# Altium schematic sheet FPGA.SchDoc
size A3
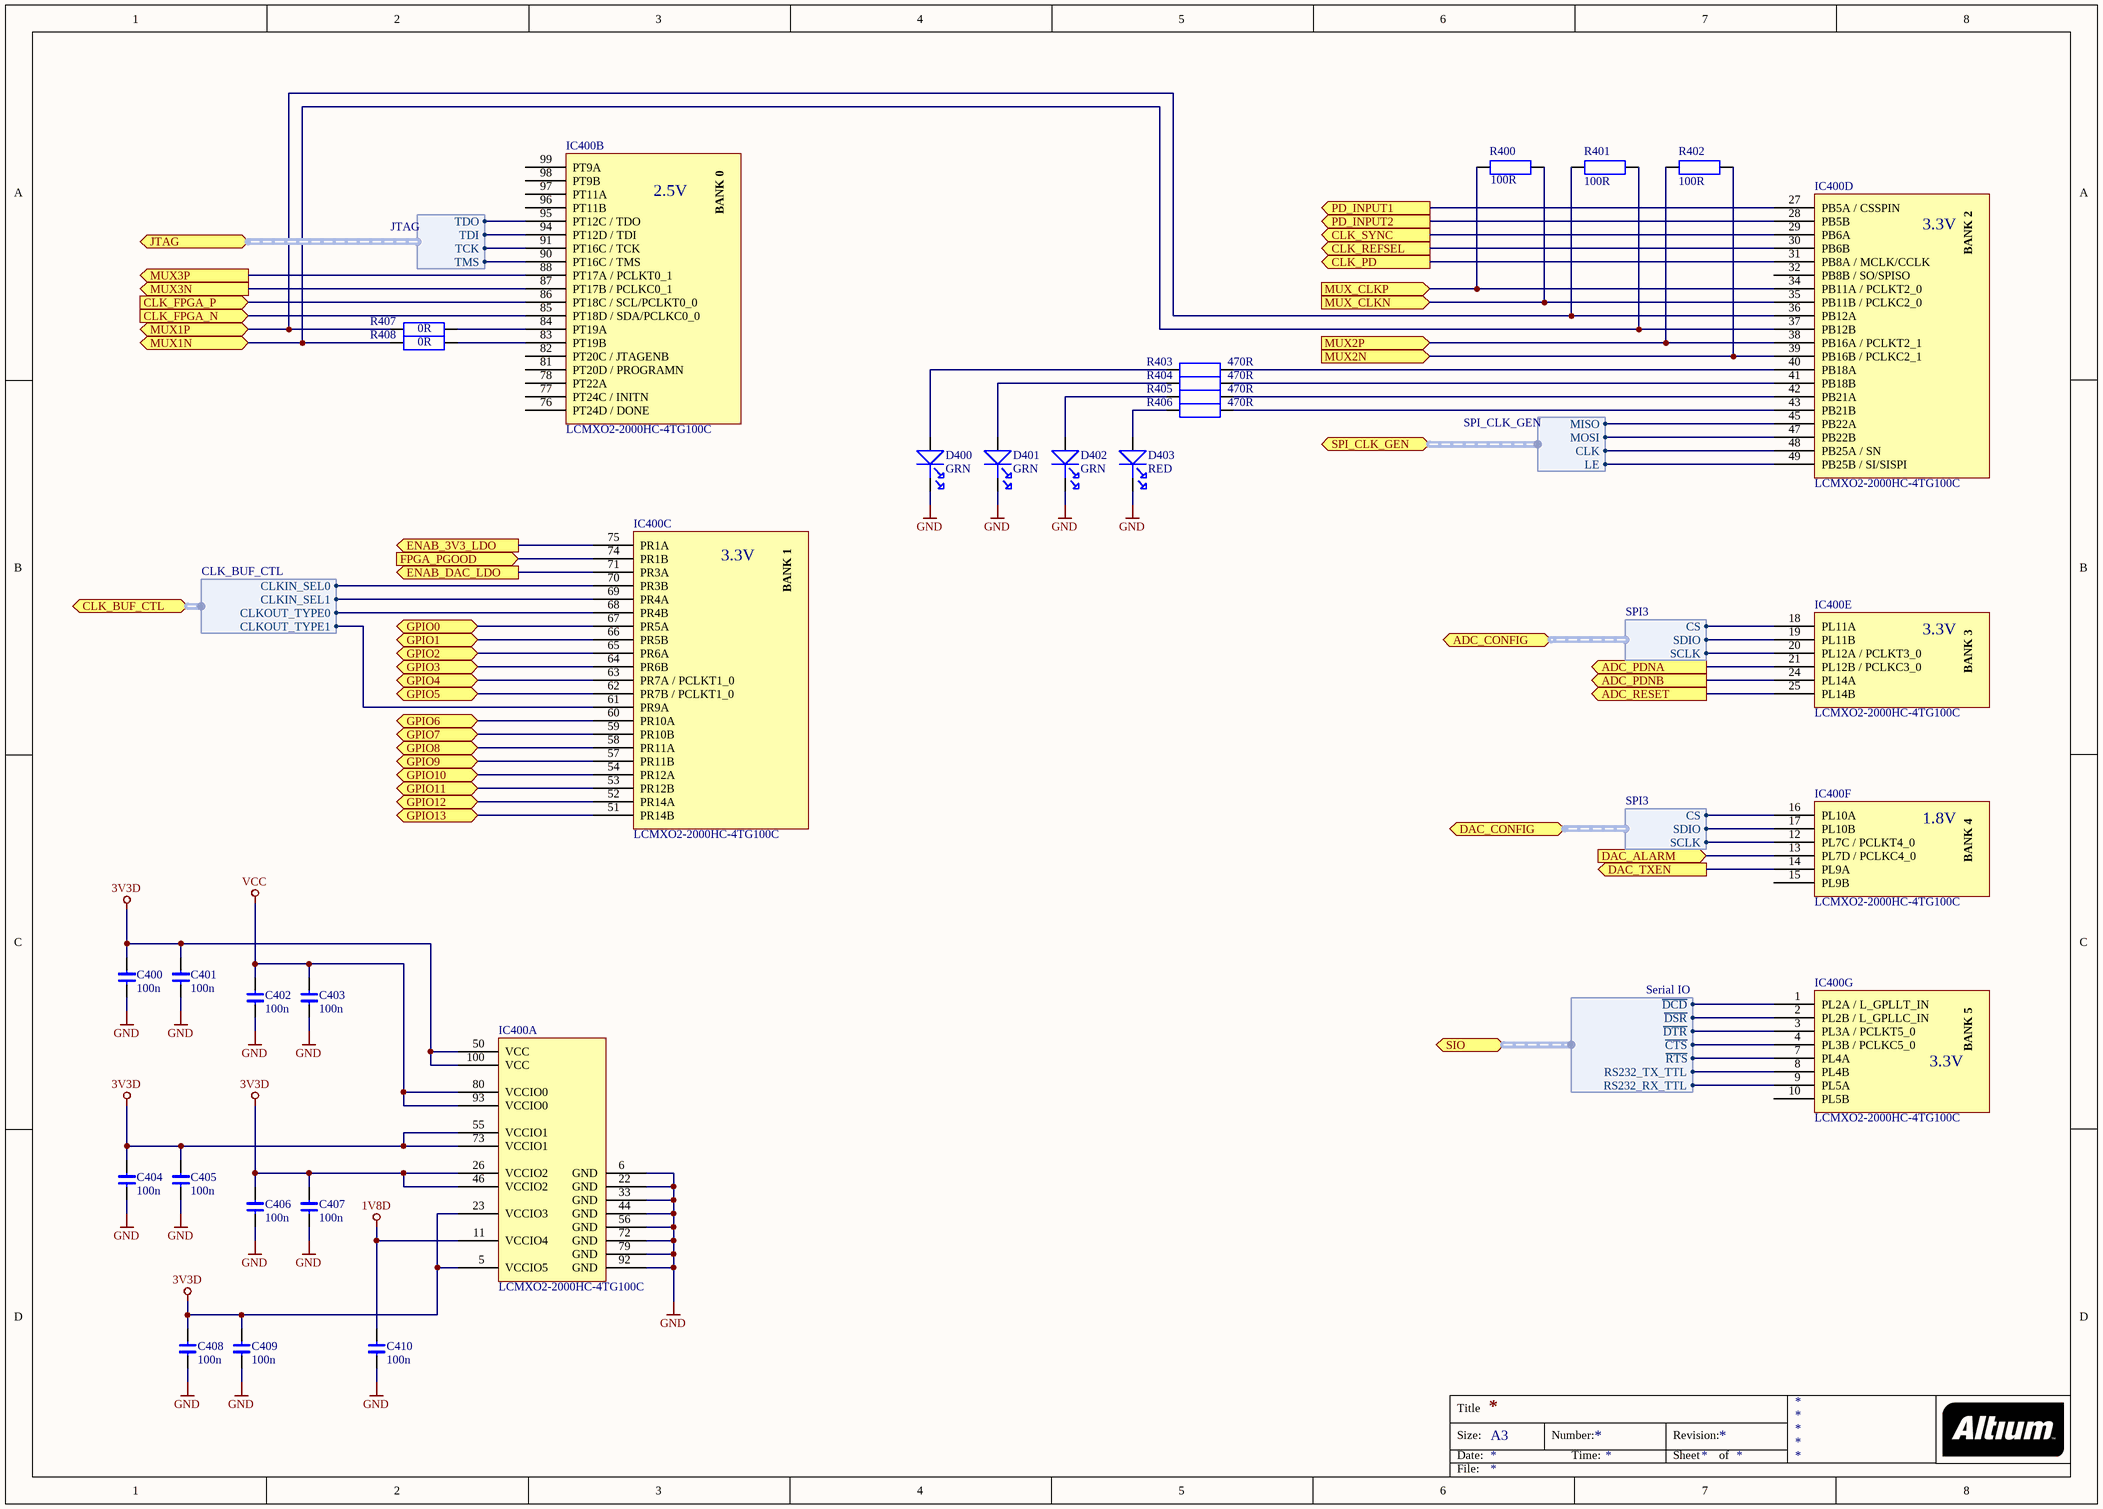
[diagram p0: FPGA.SchDoc]

## Parts
C400  100n  [0603 SMALL OUTLINE]
C401  100n  [0603 SMALL OUTLINE]
C402  100n  [0603 SMALL OUTLINE]
C403  100n  [0603 SMALL OUTLINE]
C404  100n  [0603 SMALL OUTLINE]
C405  100n  [0603 SMALL OUTLINE]
C406  100n  [0603 SMALL OUTLINE]
C407  100n  [0603 SMALL OUTLINE]
C408  100n  [0603 SMALL OUTLINE]
C409  100n  [0603 SMALL OUTLINE]
C410  100n  [0603 SMALL OUTLINE]
D400  GRN  [LED SMD 0603]
D401  GRN  [LED SMD 0603]
D402  GRN  [LED SMD 0603]
D403  RED  [LED SMD 0603]
IC400  LCMXO2-2000HC-4TG100C  [TQFP100]  (parts A,B,C,D,E,F,G of 7)
R400  100R  [0402]
R401  100R  [0402]
R402  100R  [0402]
R403  470R  [0603 SMALL OUTLINE]
R404  470R  [0603 SMALL OUTLINE]
R405  470R  [0603 SMALL OUTLINE]
R406  470R  [0603 SMALL OUTLINE]
R407  0R  [0402]
R408  0R  [0402]

## Ports
ADC_CONFIG (harness SPI3), ADC_PDNA (out), ADC_PDNB (out), ADC_RESET (out), CLK_BUF_CTL (harness CLK_BUF_CTL), CLK_FPGA_N (in), CLK_FPGA_P (in), CLK_PD (out), CLK_REFSEL (out), CLK_SYNC (out), DAC_ALARM (in), DAC_CONFIG (harness SPI3), DAC_TXEN (out), ENAB_3V3_LDO (out), ENAB_DAC_LDO (out), FPGA_PGOOD (in), GPIO0, GPIO1, GPIO2, GPIO3, GPIO4, GPIO5, GPIO6, GPIO7, GPIO8, GPIO9, GPIO10, GPIO11, GPIO12, GPIO13, JTAG (harness JTAG), MUX1N, MUX1P, MUX2N (in), MUX2P (in), MUX3N (out), MUX3P (out), MUX_CLKN (in), MUX_CLKP (in), PD_INPUT1 (out), PD_INPUT2 (out), SIO (harness Serial IO), SPI_CLK_GEN (harness SPI_CLK_GEN)

## Harnesses
JTAG: TCK, TDI, TDO, TMS
Serial IO: RS232_RX_TTL, RS232_TX_TTL, ~{RTS}, ~{CTS}, ~{DTR}, ~{DSR}, ~{DCD}
SPI3: SDIO, SCLK, CS
SPI_CLK_GEN: MISO, MOSI, CLK, LE
CLK_BUF_CTL: CLKIN_SEL0, CLKIN_SEL1, CLKOUT_TYPE0, CLKOUT_TYPE1

## Nets
1V8D: C410.1 IC400.11(VCCIO4)
3V3D: C400.1 C401.1 C404.1 C405.1 C406.1 C407.1 C408.1 C409.1 IC400.5(VCCIO5) IC400.23(VCCIO3) IC400.26(VCCIO2) IC400.46(VCCIO2) IC400.50(VCC) IC400.55(VCCIO1) IC400.73(VCCIO1) IC400.100(VCC)
GND: C400.2 C401.2 C402.2 C403.2 C404.2 C405.2 C406.2 C407.2 C408.2 C409.2 C410.2 D400.K D401.K D402.K D403.K IC400.6(GND) IC400.22(GND) IC400.33(GND) IC400.44(GND) IC400.56(GND) IC400.72(GND) IC400.79(GND) IC400.92(GND)
VCC: C402.1 C403.1 IC400.80(VCCIO0) IC400.93(VCCIO0)
ADC_PDNA: IC400.21(PL12B_/_PCLKC3_0) ; port ADC_PDNA
ADC_PDNB: IC400.24(PL14A) ; port ADC_PDNB
ADC_RESET: IC400.25(PL14B) ; port ADC_RESET
CLK_FPGA_N: IC400.85(PT18D_/_SDA/PCLKC0_0) ; port CLK_FPGA_N
CLK_FPGA_P: IC400.86(PT18C_/_SCL/PCLKT0_0) ; port CLK_FPGA_P
CLK_PD: IC400.31(PB8A_/_MCLK/CCLK) ; port CLK_PD
CLK_REFSEL: IC400.30(PB6B) ; port CLK_REFSEL
CLK_SYNC: IC400.29(PB6A) ; port CLK_SYNC
DAC_ALARM: IC400.13(PL7D_/_PCLKC4_0) ; port DAC_ALARM
DAC_TXEN: IC400.14(PL9A) ; port DAC_TXEN
ENAB_3V3_LDO: IC400.75(PR1A) ; port ENAB_3V3_LDO
ENAB_DAC_LDO: IC400.71(PR3A) ; port ENAB_DAC_LDO
FPGA_PGOOD: IC400.74(PR1B) ; port FPGA_PGOOD
GPIO0: IC400.67(PR5A) ; port GPIO0
GPIO1: IC400.66(PR5B) ; port GPIO1
GPIO2: IC400.65(PR6A) ; port GPIO2
GPIO3: IC400.64(PR6B) ; port GPIO3
GPIO4: IC400.63(PR7A_/_PCLKT1_0) ; port GPIO4
GPIO5: IC400.62(PR7B_/_PCLKT1_0) ; port GPIO5
GPIO6: IC400.60(PR10A) ; port GPIO6
GPIO7: IC400.59(PR10B) ; port GPIO7
GPIO8: IC400.58(PR11A) ; port GPIO8
GPIO9: IC400.57(PR11B) ; port GPIO9
GPIO10: IC400.54(PR12A) ; port GPIO10
GPIO11: IC400.53(PR12B) ; port GPIO11
GPIO12: IC400.52(PR14A) ; port GPIO12
GPIO13: IC400.51(PR14B) ; port GPIO13
MUX1N: IC400.37(PB12B) R401.1 R408.2 ; port MUX1N
MUX1P: IC400.36(PB12A) R401.2 R407.2 ; port MUX1P
MUX2N: IC400.39(PB16B_/_PCLKC2_1) R402.1 ; port MUX2N
MUX2P: IC400.38(PB16A_/_PCLKT2_1) R402.2 ; port MUX2P
MUX3N: IC400.87(PT17B_/_PCLKC0_1) ; port MUX3N
MUX3P: IC400.88(PT17A_/_PCLKT0_1) ; port MUX3P
MUX_CLKN: IC400.35(PB11B_/_PCLKC2_0) R400.1 ; port MUX_CLKN
MUX_CLKP: IC400.34(PB11A_/_PCLKT2_0) R400.2 ; port MUX_CLKP
PD_INPUT1: IC400.27(PB5A_/_CSSPIN) ; port PD_INPUT1
PD_INPUT2: IC400.28(PB5B) ; port PD_INPUT2
NetD400_A: D400.A R403.2
NetD401_A: D401.A R404.2
NetD402_A: D402.A R405.2
NetD403_A: D403.A R406.2
NetIC400_1: IC400.1(PL2A_/_L_GPLLT_IN) ; port SIO.~{DCD}
NetIC400_2: IC400.2(PL2B_/_L_GPLLC_IN) ; port SIO.~{DSR}
NetIC400_3: IC400.3(PL3A_/_PCLKT5_0) ; port SIO.~{DTR}
NetIC400_4: IC400.4(PL3B_/_PCLKC5_0) ; port SIO.~{CTS}
NetIC400_7: IC400.7(PL4A) ; port SIO.~{RTS}
NetIC400_8: IC400.8(PL4B) ; port SIO.RS232_TX_TTL
NetIC400_9: IC400.9(PL5A) ; port SIO.RS232_RX_TTL
NetIC400_12: IC400.12(PL7C_/_PCLKT4_0) ; port DAC_CONFIG.SCLK
NetIC400_16: IC400.16(PL10A) ; port DAC_CONFIG.CS
NetIC400_17: IC400.17(PL10B) ; port DAC_CONFIG.SDIO
NetIC400_18: IC400.18(PL11A) ; port ADC_CONFIG.CS
NetIC400_19: IC400.19(PL11B) ; port ADC_CONFIG.SDIO
NetIC400_20: IC400.20(PL12A_/_PCLKT3_0) ; port ADC_CONFIG.SCLK
NetIC400_40: IC400.40(PB18A) R403.1
NetIC400_41: IC400.41(PB18B) R404.1
NetIC400_42: IC400.42(PB21A) R405.1
NetIC400_43: IC400.43(PB21B) R406.1
NetIC400_45: IC400.45(PB22A) ; port SPI_CLK_GEN.MISO
NetIC400_47: IC400.47(PB22B) ; port SPI_CLK_GEN.MOSI
NetIC400_48: IC400.48(PB25A_/_SN) ; port SPI_CLK_GEN.CLK
NetIC400_49: IC400.49(PB25B_/_SI/SISPI) ; port SPI_CLK_GEN.LE
NetIC400_61: IC400.61(PR9A) ; port CLK_BUF_CTL.CLKOUT_TYPE1
NetIC400_68: IC400.68(PR4B) ; port CLK_BUF_CTL.CLKOUT_TYPE0
NetIC400_69: IC400.69(PR4A) ; port CLK_BUF_CTL.CLKIN_SEL1
NetIC400_70: IC400.70(PR3B) ; port CLK_BUF_CTL.CLKIN_SEL0
NetIC400_83: IC400.83(PT19B) R408.1
NetIC400_84: IC400.84(PT19A) R407.1
NetIC400_90: IC400.90(PT16C_/_TMS) ; port JTAG.TMS
NetIC400_91: IC400.91(PT16C_/_TCK) ; port JTAG.TCK
NetIC400_94: IC400.94(PT12D_/_TDI) ; port JTAG.TDI
NetIC400_95: IC400.95(PT12C_/_TDO) ; port JTAG.TDO

Not connected (* = marked no-connect by the designer): IC400 10(PL5B) 15(PL9B) 32(PB8B_/_SO/SPISO) 76(PT24D_/_DONE) 77(PT24C_/_INITN) 78(PT22A) 81(PT20D_/_PROGRAMN) 82(PT20C_/_JTAGENB) 96(PT11B) 97(PT11A) 98(PT9B) 99(PT9A)

## Notes on the sheet
- 2.5V
- 3.3V
- 1.8V
- Title
- Size:
- Date:
- A3
- Number:
- Time:
- Revision:
- Sheet
- of
- File:
- (in symbol LCMXO2-2000HC-4TG100C, part B) BANK 0
- (in symbol LCMXO2-2000HC-4TG100C, part C) BANK 1
- (in symbol LCMXO2-2000HC-4TG100C, part D) BANK 2
- (in symbol LCMXO2-2000HC-4TG100C, part E) BANK 3
- (in symbol LCMXO2-2000HC-4TG100C, part F) BANK 4
- (in symbol LCMXO2-2000HC-4TG100C, part G) BANK 5

## Library data of the parts
C400-C410 = C
D400-D402 = LED SMD: WURTH 150060VS75000
D403 = LED SMD: WURTH 150060SS75000
IC400 = LCMXO2-2000HC-4TG100C: Lattice MachXO2
R400-R408 = R